# EAGLE schematic dosimeter (EAGLE 6.1)

## Sheet 1 of 2
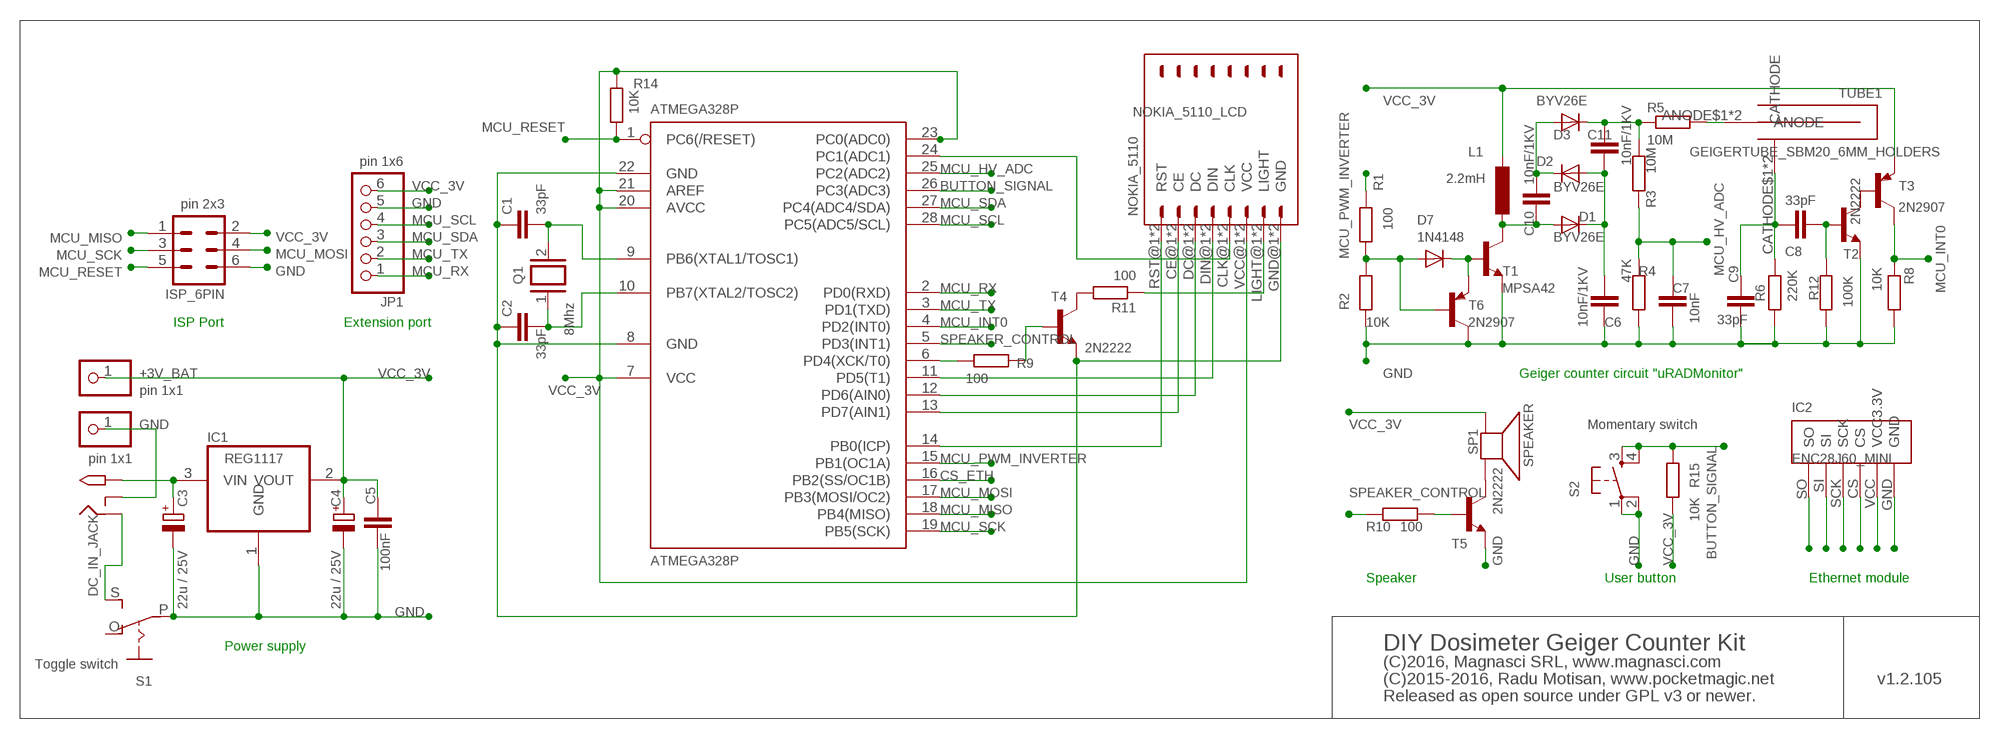
[diagram p0: schematic, sheet 1]

### Parts
+3V_BAT  pin 1x1  PINHD-1X1  [1X01]
ATMEGA328P  ATMEGA328P  MEGA8-P  [DIL28-3]
C1  33pF  C2.5/2  [C2.5-2]
C2  33pF  C2.5/2  [C2.5-2]
C3  22u / 25V  CPOL-EUTT2D4L  [TT2D4L]
C4  22u / 25V  CPOL-EUTT2D4L  [TT2D4L]
C5  100nF  C2.5/2  [C2.5-2]
C6  10nF/1KV  C5/3  [C5B3]
C7  10nF  C2.5/2  [C2.5-2]
C8  33pF  C2.5/2  [C2.5-2]
C9  33pF  C2.5/2  [C2.5-2]
C10  10nF/1KV  C5/3  [C5B3]
C11  10nF/1KV  C5/3  [C5B3]
D1  BYV26E  DIODE-DO41-7.6  [DO41-7.6]
D2  BYV26E  DIODE-DO41-7.6  [DO41-7.6]
D3  BYV26E  DIODE-DO41-7.6  [DO41-7.6]
D7  1N4148  DIODE-D-5  [D-5]
DC_IN_JACK  DC IN JACK  2.1MMJACKTHM  [PJ-102A]
GND  pin 1x1  PINHD-1X1  [1X01]
IC1  REG1117  [SOT223]
IC2  ENC28J60_MINI  [ENC28J60_MINI]
ISP_6PIN  pin 2x3  MA03-2  [MA03-2]
JP1  pin 1x6  PINHD-1X6CLEAN  [1X06-CLEAN]
L1  2.2mH  L-EU0207/10  [0207/10]
NOKIA_5110  NOKIA_5110_LCD  NOKIA5110  [NOKIA5110]
Q1  8Mhz  XTAL/S  [QS]
R1  100  R-EU_0204/7  [0204/7]
R2  10K  R-EU_0204/7  [0204/7]
R3  10M  R-EU_0204/7  [0204/7]
R4  47K  R-EU_0204/7  [0204/7]
R5  10M  R-EU_0204/7  [0204/7]
R6  220K  R-EU_0204/7  [0204/7]
R8  10K  R-EU_0204/7  [0204/7]
R9  100  R-EU_0204/7  [0204/7]
R10  100  R-EU_0204/7  [0204/7]
R11  100  R-EU_0204/7  [0204/7]
R12  100K  R-EU_0204/7  [0204/7]
R14  10K  R-EU_0204/7  [0204/7]
R15  10K  R-EU_0204/7  [0204/7]
S1  Toggle switch  EG1218S  [EG1218]
S2  Momentary switch  TAC_SWITCHPTH  [TACTILE-PTH]
SP1  SPEAKER  SPEAKER/AL60P  [AL60P]
T1  MPSA42  2N2222  [TO92-EBC-OVAL]
T2  2N2222  2N2222-NPN-TO92-EBC  [TO92-EBC]
T3  2N2907  [TO92-EBC-OVAL]
T4  2N2222  2N2222-NPN-TO92-EBC  [TO92-EBC]
T5  2N2222  2N2222-NPN-TO92-EBC  [TO92-EBC]
T6  2N2907  [TO92-EBC-OVAL]
TUBE1  GEIGERTUBE_SBM20_6MM_HOLDERS  [GEIGERTUBE_SBM20_6MM_HOLDERS]

### Nets
BUTTON_SIGNAL: ATMEGA328P.26(PC3(ADC3)) R15.1 S2.3 S2.4
CS_ETH: ATMEGA328P.16(PB2(SS/OC1B)) IC2.CS
GND: ATMEGA328P.8(GND) ATMEGA328P.22(GND) C1.1 C2.1 C3.- C4.- C5.1 C6.2 C7.1 C9.2 IC1.1(GND) IC2.GND ISP_6PIN.6 JP1.5 NOKIA_5110.GND@1(GND) NOKIA_5110.GND@2(GND) R2.1 R4.2 R6.1 R8.2 R12.2 S1.P S2.1 S2.2 T1.E T2.E T4.E T5.E T6.C
MCU_HV_ADC: ATMEGA328P.25(PC2(ADC2)) C7.2 R3.1 R4.1
MCU_INT0: ATMEGA328P.4(PD2(INT0)) R8.1 T3.C
MCU_MISO: ATMEGA328P.18(PB4(MISO)) IC2.SO ISP_6PIN.1
MCU_MOSI: ATMEGA328P.17(PB3(MOSI/OC2)) IC2.SI ISP_6PIN.4
MCU_PWM_INVERTER: ATMEGA328P.15(PB1(OC1A)) R1.1
MCU_RESET: ATMEGA328P.1(PC6(/RESET)) ISP_6PIN.5 R14.1
MCU_RX: ATMEGA328P.2(PD0(RXD)) JP1.1
MCU_SCK: ATMEGA328P.19(PB5(SCK)) IC2.SCK ISP_6PIN.3
MCU_SCL: ATMEGA328P.28(PC5(ADC5/SCL)) JP1.4
MCU_SDA: ATMEGA328P.27(PC4(ADC4/SDA)) JP1.3
MCU_TX: ATMEGA328P.3(PD1(TXD)) JP1.2
N$1: ATMEGA328P.9(PB6(XTAL1/TOSC1)) C1.2 Q1.2
N$2: ATMEGA328P.10(PB7(XTAL2/TOSC2)) C2.2 Q1.1
N$3: R11.2 T4.C
N$4: R5.2 TUBE1.ANODE$1(ANODE) TUBE1.ANODE$2(ANODE)
N$7: R9.2 T4.B
N$9: NOKIA_5110.LIGHT@1(LIGHT) NOKIA_5110.LIGHT@2(LIGHT) R11.1
N$10: C10.2 D1.A L1.2 T1.C
N$13: ATMEGA328P.24(PC1(ADC1)) NOKIA_5110.CLK@1(CLK) NOKIA_5110.CLK@2(CLK)
N$15: DC_IN_JACK.RING S1.S
N$16: C10.1 D2.C D3.A
N$20: DC_IN_JACK.RING_SW GND.1
N$21: ATMEGA328P.11(PD5(T1)) NOKIA_5110.DIN@1(DIN) NOKIA_5110.DIN@2(DIN)
N$22: ATMEGA328P.12(PD6(AIN0)) NOKIA_5110.DC@1(DC) NOKIA_5110.DC@2(DC)
N$23: ATMEGA328P.13(PD7(AIN1)) NOKIA_5110.CE@1(CE) NOKIA_5110.CE@2(CE)
N$24: ATMEGA328P.14(PB0(ICP)) NOKIA_5110.RST@1(RST) NOKIA_5110.RST@2(RST)
N$27: D7.A R1.2 R2.2 T6.B
N$28: C3.+ DC_IN_JACK.TIP IC1.3(VIN)
N$30: C6.1 C11.2 D1.C D2.A
N$31: C11.1 D3.C R3.2 R5.1
N$34: ATMEGA328P.6(PD4(XCK/T0)) R9.1
N$40: SP1.2(-) T5.C
N$41: R10.2 T5.B
N$52: C8.2 C9.1 R6.2 TUBE1.CATHODE$1(CATHODE) TUBE1.CATHODE$2(CATHODE)
N$56: C8.1 R12.1 T2.B
N$59: T2.C T3.B
N$74: D7.C T1.B T6.E
SPEAKER_CONTROL: ATMEGA328P.5(PD3(INT1)) R10.1
VCC_3V: +3V_BAT.1 ATMEGA328P.7(VCC) ATMEGA328P.20(AVCC) ATMEGA328P.21(AREF) ATMEGA328P.23(PC0(ADC0)) C4.+ C5.2 IC1.2(VOUT) IC2.VCC(VCC3.3V) ISP_6PIN.2 JP1.6 L1.1 NOKIA_5110.VCC@1(VCC) NOKIA_5110.VCC@2(VCC) R14.2 R15.2 SP1.1(+) T3.E
Unconnected: S1.O

### Notes on the sheet
- ISP Port | Extension port
- Geiger counter circuit "uRADMonitor"
- Speaker | User button | Ethernet module
- Power supply | DIY Dosimeter Geiger Counter Kit
- (C)2016, Magnasci SRL, www.magnasci.com
- (C)2015-2016, Radu Motisan, www.pocketmagic.net | v1.2.105
- Released as open source under GPL v3 or newer.

## Sheet 2 of 2

## Library data of the parts
+3V_BAT GND = adafruit:PINHD-1X1: Pin header 1x1 for 0.1" spacing With round pins
ATMEGA328P = atmel:MEGA8-P: MICROCONTROLLER 8 Kbytes FLASH, 1 kbytes SRAM, 512 bytes EEPROM, USART, 4-channel 10 bit ADC, 2-channel 8 bit ADC Pin compatible with Atmega48, ATMega88, ATMega168 Source: avr.lbr; OC_FARNELL: unknown; OC_NEWARK: unknown
C1 C2 C5-C11 = capacitor-wima:C: CAPACITOR naming: grid - package width
C3 C4 = rcl:CPOL-EU: POLARIZED CAPACITOR, European symbol
D1-D3 D7 = diode:DIODE-: DIODE
DC_IN_JACK = adafruit:2.1MMJACK: 2.1mm x 5.5mm THM DC jack with internal switch. Digikey part #PJ-102A, 4UCON part #05537 2.1mm x 5.5mm SMT DC jack with internal switch. Digikey part #PJ-002A-SMT, 4UCON part #03267 By microbuilder.eu & adafruit.com
IC1 = burr-brown:REG1117: 800mA and 1A Low Dropout (LDO) Positive Regulator 1.8V, 2.5V, 2.85V, 3.3V, 5V, and Adj; MPN: REG1117; OC_FARNELL: 1097566; OC_NEWARK: 14P6981
IC2 = uradmonitor:ENC28J60_MINI
ISP_6PIN = con-lstb:MA03-2: PIN HEADER; OC_FARNELL: unknown; OC_NEWARK: unknown
JP1 = adafruit:PINHD-1X6: PIN HEADER
L1 = rcl:L-EU: INDUCTOR, European symbol
NOKIA_5110 = pocketmagic:NOKIA5110
Q1 = special:XTAL/S: CRYSTAL
R1-R6 R8-R12 R14 R15 = rcl:R-EU_: RESISTOR, European symbol
S1 = adafruit:EG1218: SLIDING SWITCH 0.1" spacing through hole, vertical SPDT slide switch http://www.ladyada.net/library/pcb/eaglelibrary.html
S2 = sparkfun-electromechanical:TAC_SWITCH: Momentary Switch Button commonly used for reset or general input. Spark Fun Electronics SKU : COM-00097 SMT- SWCH-08247
SP1 = adafruit:SPEAKER: SPEAKER Source: Buerklin Added PS12 (for part # PS1240 piezo) http://www.ladyada.net/library/pcb/eaglelibrary.html
T1 = adafruit:2N2222: NPN TRANSISTOR Big oval pads
T2 T4 T5 = transistor-neu-to92:*-NPN-: NPN Transistror
T3 T6 = adafruit:2N2907*: PNP Transistor Big Oval pads
TUBE1 = uradmonitor:GEIGERTUBE_SBM20_6MM_HOLDERS